# EAGLE schematic untitled (EAGLE 6.1)
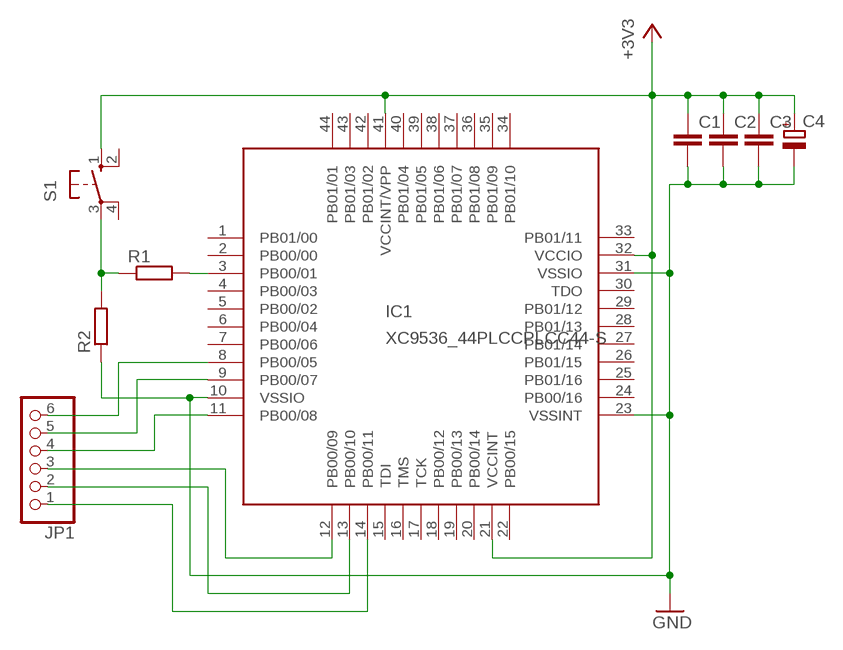
[diagram p0: schematic, sheet 1]

## Parts
C1  C-EU050-025X075  [C050-025X075]
C2  C-EU050-025X075  [C050-025X075]
C3  C-EU050-025X075  [C050-025X075]
C4  CPOL-EUE2.5-6  [E2,5-6]
IC1  XC9536_44PLCCPLCC44-S  [PLCC-S44]
JP1  PINHD-1X6  [1X06]
R1  R-EU_0204/7  [0204/7]
R2  R-EU_0204/7  [0204/7]
S1  10-XX  [B3F-10XX]

## Nets
+3V3: C1.1 C2.1 C3.1 C4.+ IC1.21(VCCINT) IC1.32(VCCIO) IC1.41(VCCINT/VPP) S1.1(S)
GND: C1.2 C2.2 C3.2 C4.- IC1.10(VSSIO) IC1.23(VSSINT) IC1.31(VSSIO) R2.1
N$1: IC1.8(PB00/05) JP1.6
N$2: IC1.9(PB00/07) JP1.5
N$3: IC1.3(PB00/01) R1.2
N$4: R1.1 R2.2 S1.3(P)
N$5: IC1.11(PB00/08) JP1.4
N$6: IC1.12(PB00/09) JP1.3
N$7: IC1.13(PB00/10) JP1.2
N$8: IC1.14(PB00/11) JP1.1
Unconnected: IC1.1(PB01/00) IC1.2(PB00/00) IC1.4(PB00/03) IC1.5(PB00/02) IC1.6(PB00/04) IC1.7(PB00/06) IC1.15(TDI) IC1.16(TMS) IC1.17(TCK) IC1.18(PB00/12) IC1.19(PB00/13) IC1.20(PB00/14) IC1.22(PB00/15) IC1.24(PB00/16) IC1.25(PB01/16) IC1.26(PB01/15) IC1.27(PB01/14) IC1.28(PB01/13) IC1.29(PB01/12) IC1.30(TDO) IC1.33(PB01/11) IC1.34(PB01/10) IC1.35(PB01/09) IC1.36(PB01/08) IC1.37(PB01/07) IC1.38(PB01/06) IC1.39(PB01/05) IC1.40(PB01/04) IC1.42(PB01/02) IC1.43(PB01/03) IC1.44(PB01/01) S1.2(S1) S1.4(P1)

## Library data of the parts
C1-C3 = rcl:C-EU: CAPACITOR, European symbol
C4 = rcl:CPOL-EU: POLARIZED CAPACITOR, European symbol
IC1 = xilinx-xc9-socket:XC9536_44PLCC: xc9536_pc44 XC9500 In-System Programmable CPLD Family Auto generated by make-symbol-device-package-bsdl.ulp Rev. 34 Source: xc9536_pc44.bsd
JP1 = pinhead:PINHD-1X6: PIN HEADER
R1 R2 = rcl:R-EU_: RESISTOR, European symbol
S1 = switch-omron (2):10-XX: OMRON SWITCH